# Altium schematic sheet USB-C.SchDoc
size A4; SheetNumber: 2; SheetTotal: 6
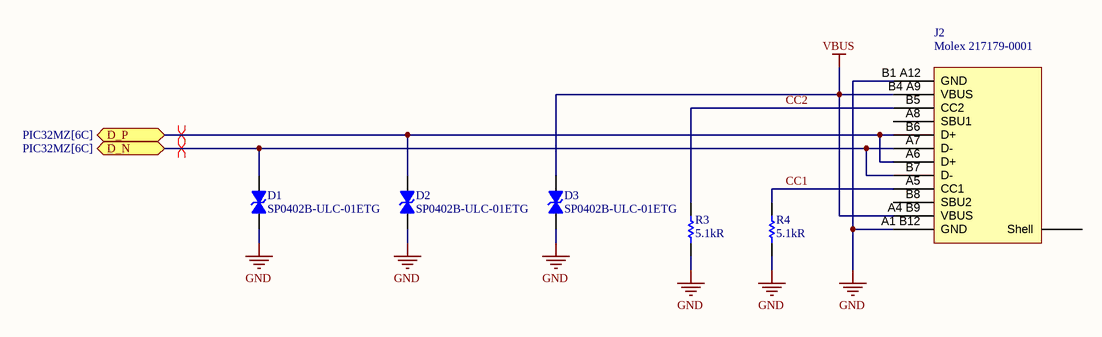
[diagram p0: USB-C.SchDoc]

## Parts
D1  SP0402B-ULC-01ETG  [Diode TVS 0402]
D2  SP0402B-ULC-01ETG  [Diode TVS 0402]
D3  SP0402B-ULC-01ETG  [Diode TVS 0402]
J2  Molex 217179-0001  [Molex 217179-0001]
R3  5.1kR  [Resistor 0402]
R4  5.1kR  [Resistor 0402]

## Ports
D_N (bidir, see PIC32MZ[6C]), D_P (bidir, see PIC32MZ[6C])

## Nets
GND: D1.2 D2.2 D3.2 J2.A1_B12(GND) J2.B1_A12(GND) R3.1 R4.1
VBUS: D3.1 J2.A4_B9(VBUS) J2.B4_A9(VBUS)
CC1: J2.A5(CC1) R4.2
CC2: J2.B5(CC2) R3.2
D_N: D1.1 J2.A7(D-) J2.B7(D-) ; port D_N
D_P: D2.1 J2.A6(D+) J2.B6(D+) ; port D_P

Not connected (* = marked no-connect by the designer): J2 A8(SBU1) B8(SBU2) Shell

## Layout directives
differential pair: D_N, D_P

## Notes on the sheet
- TITLE
- SIZE
- A4
- VARIANT
- PROJECT
- SHEET
- VERSION
- OF
- AUTHOR
- DATE

## Library data of the parts
D1-D3 = Diode TVS
J2 = USB-C Receptacle (16 Pin)
R3 R4 = Resistor